# EAGLE design PhatStats Slim Enclosure QTPY PCB v1.00 RTM XPT2406  (EAGLE 7.6.0)
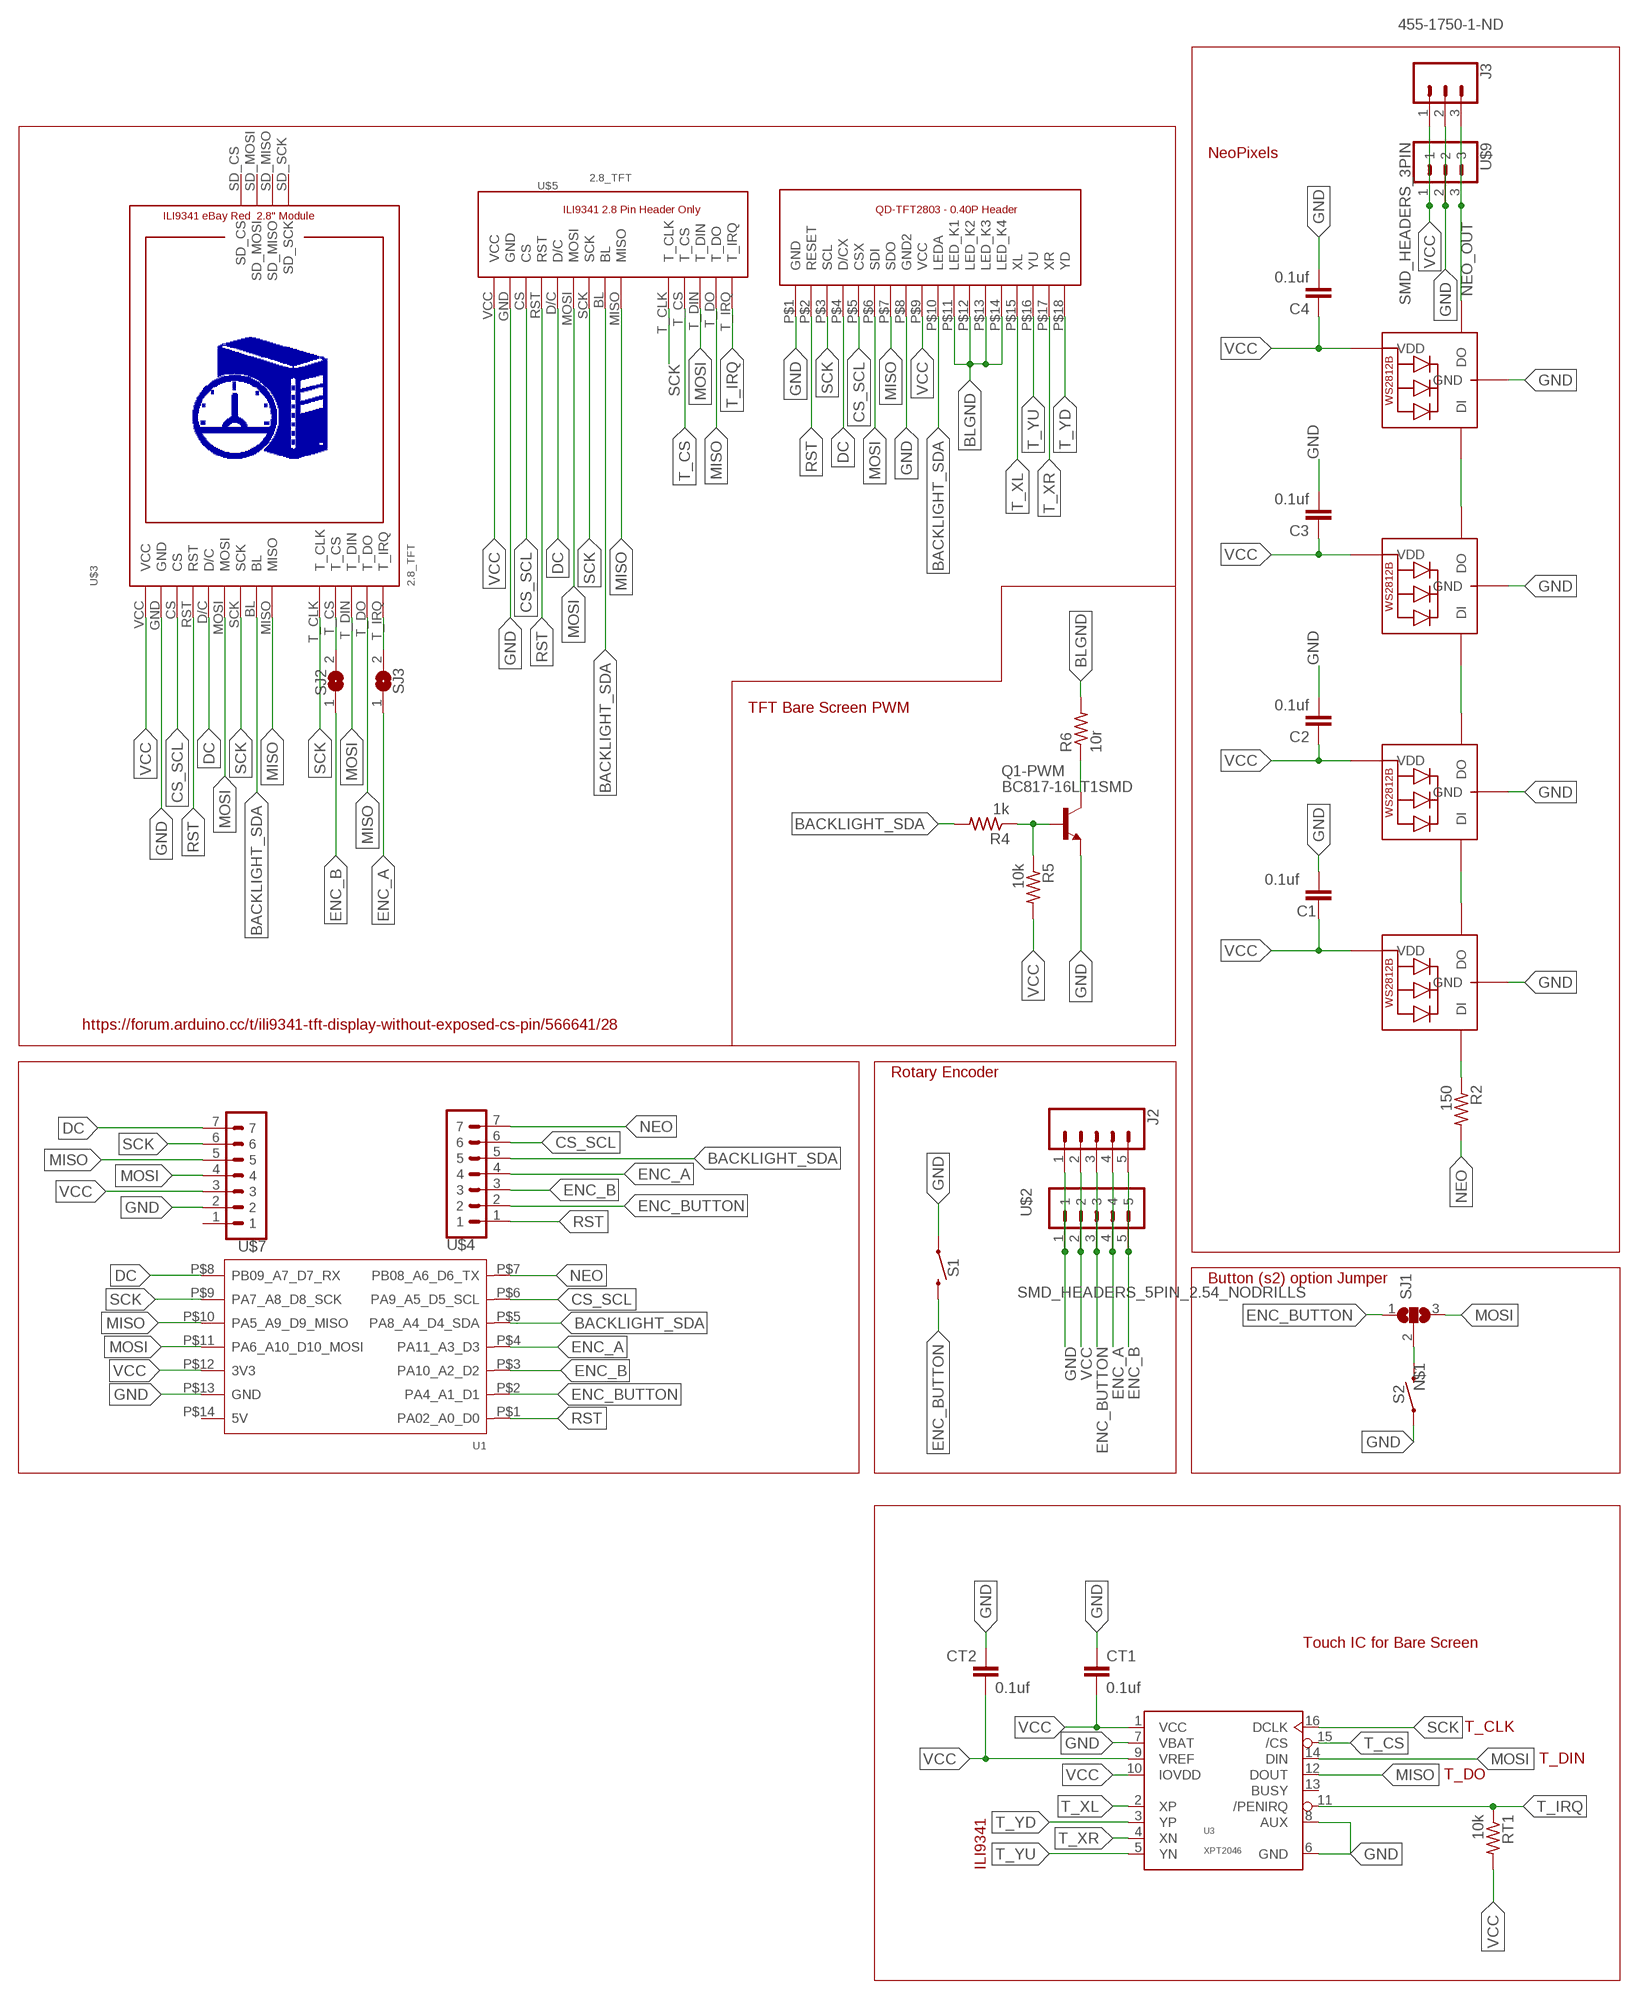
[diagram p0: schematic, sheet 1]

## Parts
0  ILI9341-2.8  [ILI9341-2.8]
C1  0.1uf  C-EUC1206  [C1206]
C2  0.1uf  C-EUC1206  [C1206]
C3  0.1uf  C-EUC1206  [C1206]
C4  0.1uf  C-EUC1206  [C1206]
CT1  0.1uf  C-EUC1206  [C1206]
CT2  0.1uf  C-EUC1206  [C1206]
J2  CONN_05  [1X05]
J3  455-1750-1-ND  CONN_03  [1X03]
NEO1  WS2812B5050  [WS2812B]
NEO2  WS2812B5050  [WS2812B]
NEO3  WS2812B5050  [WS2812B]
NEO4  WS2812B5050  [WS2812B]
Q1-PWM  BC817-16LT1SMD  [SOT23-BEC]
R2  150  R-US_M1206  [M1206]
R4  1k  R-US_M1206  [M1206]
R5  10k  R-US_M1206  [M1206]
R6  10r  R-US_M1206  [M1206]
RT1  10k  R-US_M1206  [M1206]
S1  MOMENTARY-SWITCH-SPST-SMD-6.2MM-TALL  [TACTILE_SWITCH_SMD_6.2MM_TALL]
S2  MOMENTARY-SWITCH-SPST-SMD-6.2MM-TALL  [TACTILE_SWITCH_SMD_6.2MM_TALL]
SJ1  SJ2W  [SJ_2]
SJ2  SJ  [SJ]
SJ3  SJ  [SJ]
U1  MOUDLE-SEEEDUINO-XIAO  [MOUDLE14P-2.54-21X17.8MM]
U3  XPT2046  [TSSOP-16]
U$2  SMD_HEADERS_5PIN_2.54_NODRILLS  [SMD_HEADERS_5PIN]
U$3  2.8_TFT  [2.8_TFT]
U$4  SMD_HEADERS_7PIN_2.54_NODRILLS  [SMD_HEADERS_7PIN]
U$5  2.8_TFT  [2.8_TFT]
U$7  SMD_HEADERS_7PIN_2.54_NODRILLS  [SMD_HEADERS_7PIN]
U$9  SMD_HEADERS_3PIN  [SMD_HEADERS_3PIN]

## Nets
BACKLIGHT_SDA: 0.P$10(LEDA) R4.2 U1.P$5(PA8_A4_D4_SDA) U$3.BL U$4.5 U$5.BL
BLGND: 0.P$11(LED_K1) 0.P$12(LED_K2) 0.P$13(LED_K3) 0.P$14(LED_K4) R6.2
CS_SCL: 0.P$5(CSX) U1.P$6(PA9_A5_D5_SCL) U$3.CS U$4.6 U$5.CS
DC: 0.P$4(D/CX) U1.P$8(PB09_A7_D7_RX) U$3.D/C U$5.D/C U$7.7
ENC_A: J2.4 SJ3.1 U1.P$4(PA11_A3_D3) U$2.4 U$4.4
ENC_B: J2.5 SJ2.1 U1.P$3(PA10_A2_D2) U$2.5 U$4.3
ENC_BUTTON: J2.3 S1.B2 SJ1.1 U1.P$2(PA4_A1_D1) U$2.3 U$4.2
GND: 0.P$1(GND) 0.P$8(GND2) C1.1 C2.2 C3.2 C4.2 CT1.1 CT2.1 J2.1 J3.2 NEO1.3-GND(GND) NEO2.3-GND(GND) NEO3.3-GND(GND) NEO4.3-GND(GND) Q1-PWM.E S1.A2 S2.A2 U1.P$13(GND) U3.6(GND) U3.7(VBAT) U3.8(AUX) U$2.1 U$3.GND U$5.GND U$7.2 U$9.2
MISO: 0.P$7(SDO) U1.P$10(PA5_A9_D9_MISO) U3.12(DOUT) U$3.MISO U$3.T_DO U$5.MISO U$5.T_DO U$7.5
MOSI: 0.P$6(SDI) SJ1.3 U1.P$11(PA6_A10_D10_MOSI) U3.14(DIN) U$3.MOSI U$3.T_DIN U$5.MOSI U$5.T_DIN U$7.4
N$1: S2.B2 SJ1.2
N$2: Q1-PWM.B R4.1 R5.1
N$3: NEO2.2-DOUT(DO) NEO3.4-DIN(DI)
N$4: NEO1.4-DIN(DI) R2.1
N$5: NEO3.2-DOUT(DO) NEO4.4-DIN(DI)
N$6: Q1-PWM.C R6.1
NEO: R2.2 U1.P$7(PB08_A6_D6_TX) U$4.7
NEO_OUT: J3.3 NEO4.2-DOUT(DO) U$9.3
NEODATA: NEO1.2-DOUT(DO) NEO2.4-DIN(DI)
RST: 0.P$2(RESET) U1.P$1(PA02_A0_D0) U$3.RST U$4.1 U$5.RST
SCK: 0.P$3(SCL) U1.P$9(PA7_A8_D8_SCK) U3.16(DCLK) U$3.SCK U$3.T_CLK U$5.SCK U$5.T_CLK U$7.6
T_CS: SJ2.2 U3.15(/CS) U$3.T_CS U$5.T_CS
T_IRQ: RT1.1 SJ3.2 U3.11(/PENIRQ) U$3.T_IRQ U$5.T_IRQ
T_XL: 0.P$15(XL) U3.2(XP)
T_XR: 0.P$17(XR) U3.4(XN)
T_YD: 0.P$18(YD) U3.3(YP)
T_YU: 0.P$16(YU) U3.5(YN)
VCC: 0.P$9(VCC) C1.2 C2.1 C3.1 C4.1 CT1.2 CT2.2 J2.2 J3.1 NEO1.1-VDD(VDD) NEO2.1-VDD(VDD) NEO3.1-VDD(VDD) NEO4.1-VDD(VDD) R5.2 RT1.2 U1.P$12(3V3) U3.1(VCC) U3.9(VREF) U3.10(IOVDD) U$2.2 U$3.VCC U$5.VCC U$7.3 U$9.1
Unconnected: U1.P$14(5V) U3.13(BUSY) U$3.SD_CS U$3.SD_MISO U$3.SD_MOSI U$3.SD_SCK U$7.1

## Notes on the sheet
- NeoPixels
- TFT Bare Screen PWM
- https://forum.arduino.cc/t/ili9341-tft-display-without-exposed-cs-pin/566641/28
- Rotary Encoder
- Button (s2) option Jumper
- Touch IC for Bare Screen
- T_CLK
- T_DIN
- T_DO
- ILI9341

## Library data of the parts
0 = TML_ili9341_0.8Pitch_Header:ILI9341-2.8
C1-C4 CT1 CT2 = rcl:C-EU: CAPACITOR, European symbol
J2 = SparkFun-Connectors:CONN_05: Multi connection point. Often used as Generic Header-pin footprint for 0.1 inch spaced/style header connections On any of the 0.1 inch spaced packages, you can populate with these: Break Away Headers - Straight <https://www.sparkfun.com/products/116> (PRT-00116) Break Away Male Headers - Right Angle <https://www.sparkfun.com/products/553> (PRT-00553) Female Headers <https://www.sparkfun.com/products/115> (PRT-00115) Break Away Headers - Machine Pin <https://www.sparkfun.com/products/117> (PRT-00117) Break Away Female Headers - Swiss Machine Pin <https://www.sparkfun.com/products/743> (PRT-00743) For SCREWTERMINALS and SPRING TERMINALS visit here: Screw Terimnals on SparkFun.com <https://www.sparkfun.com/search/results?term=Screw+Terminals> (5mm/3.5mm/2.54mm spacing) This device is also useful as a general connection point to wire up your design to another part of your project. Our various solder wires solder well into these plated through hole pads. Hook-Up Wire - Assortment (Stranded, 22 AWG) <https://www.sparkfun.com/products/11375> (PRT-11375) Hook-Up Wire - Assortment (Solid Core, 22 AWG) <https://www.sparkfun.com/products/11367> (PRT-11367) View the entire wire category on our website here <https://www.sparkfun.com/categories/141> Special notes: Molex polarized connector foot print use with SKU : PRT-08231 with associated crimp pins and housings. 1MM SMD Version SKU: PRT-10208
J3 = SparkFun-Connectors:CONN_03: Multi connection point. Often used as Generic Header-pin footprint for 0.1 inch spaced/style header connections On any of the 0.1 inch spaced packages, you can populate with these: Break Away Headers - Straight <https://www.sparkfun.com/products/116> (PRT-00116) Break Away Male Headers - Right Angle <https://www.sparkfun.com/products/553> (PRT-00553) Female Headers <https://www.sparkfun.com/products/115> (PRT-00115) Break Away Headers - Machine Pin <https://www.sparkfun.com/products/117> (PRT-00117) Break Away Female Headers - Swiss Machine Pin <https://www.sparkfun.com/products/743> (PRT-00743) Stackable Header - 3 Pin (Female, 0.1") <https://www.sparkfun.com/products/13875> (PRT-13875) For SCREWTERMINALS and SPRING TERMINALS visit here: Screw Terimnals on SparkFun.com <https://www.sparkfun.com/search/results?term=Screw+Terminals> (5mm/3.5mm/2.54mm spacing) This device is also useful as a general connection point to wire up your design to another part of your project. Our various solder wires solder well into these plated through hole pads. Hook-Up Wire - Assortment (Stranded, 22 AWG) <https://www.sparkfun.com/products/11375> (PRT-11375) Hook-Up Wire - Assortment (Solid Core, 22 AWG) <https://www.sparkfun.com/products/11367> (PRT-11367) View the entire wire category on our website here <https://www.sparkfun.com/categories/141> Special notes: Molex polarized connector foot print use with SKU : PRT-08232 with associated crimp pins and housings.; PROD_ID: XXX-00000
NEO1-NEO4 = adafruit:WS2812B
Q1-PWM = transistor-npn:BC817*: NPN Transistor
R2 R4-R6 RT1 = resistor:R-US_: RESISTOR, American symbol
S1 S2 = SparkFun-Switches:MOMENTARY-SWITCH-SPST: Momentary Switch (Pushbutton) - SPST Normally-open (NO) SPST momentary switches (buttons, pushbuttons). Variants PTH-12MM - 12mm square, through-hole Momentary Pushbutton Switch - 12mm Square <https://www.sparkfun.com/products/9190> (COM-09190) PTH-6.0MM, PTH-6.0MM-KIT - 6.0mm square, through-hole Mini Pushbutton Switch <https://www.sparkfun.com/products/97> (COM-00097) KIT package intended for soldering kit's - only one side of pads' copper is exposed. PTH-RIGHT-ANGLE-KIT - Right-angle, through-hole Right Angle Tactile Button <https://www.sparkfun.com/products/10791> - Used on SparkFun BigTime Watch Kit <https://www.sparkfun.com/products/11734> SMD-12MM - 12mm square, surface-mount Tactile Button - SMD (12mm) <https://www.sparkfun.com/products/12993> (COM-12993) Used on SparkFun PicoBoard <https://www.sparkfun.com/products/11888> SMD-4.5MM - 4.5mm Square Trackball Switch Used on SparkFun Blackberry Trackballer Breakout <https://www.sparkfun.com/products/13169> SMD-4.6MMX2.8MM - 4.60mm x 2.80mm, surface mount Used on SparkFun SAMD21 Mini Breakout <https://www.sparkfun.com/products/13664> SMD-5.2MM, SMD-5.2-REDUNDANT - 5.2mm square, surface-mount Mini Pushbutton Switch - SMD <https://www.sparkfun.com/products/8720> (COM-08720) Used on Arduino Pro Mini <https://www.sparkfun.com/products/11114> REDUNDANT package connects both switch circuits together SMD-6.0X3.5MM - 6.0 x 3.5mm, surface mount Momentary Reset Switch SMD <https://www.sparkfun.com/products/8229> (COM-08229) SMD-6.2MM-TALL - 6.2mm square, surface mount Tactile Button - SMD (6mm) <https://www.sparkfun.com/products/12992> Used on SparkFun Digital Sandbox <https://www.sparkfun.com/products/12651> SMD-RIGHT-ANGLE - Right-angle, surface mount Used on SparkFun Block for Intel® Edison - Arduino <https://www.sparkfun.com/products/13036>; PROD_ID: SWCH-11966; SF_SKU: COM-12992
SJ1 = jumper:SJ2W: SMD solder JUMPER
SJ2 SJ3 = jumper:SJ: SMD solder JUMPER
U1 = TML_Seeeduino XIAO_QTPY_ThroughHole_ONLY_V1.1:MOUDLE-SEEEDUINO-XIAO
U3 = TML_XPT2046:XPT2046: XPT2046 touch screen controller General Description The XPT2046 is a 4-wire resistive touch screen controller that incorporates a 12-bit 125 kHz sampling SAR type A/D converter. The XPT2046 operates down to 2.2V supply voltage and supports digital I/O interface voltage from 1.5V to VCC in order to connect low voltage uP. The XPT2046 can detect the pressed screen location by performing two A/D conversions. In addition to location, the XPT2046 also measures touch screen pressure.On-chip VREF can be utilized for analog auxiliary input, temperature measurement and battery monitoring withthe ability to measure voltage from 0V to 5V. The XPT2046 also has an on-chip temperature sensor The XPT2046 is available in 16pin QFN thin package(0.75mm in height) and has the operating temperature range of -40°C to +85°C Features 12 bit SAR type A/D converter with S/H circuit Low voltage operation (VCC = 2.2V ∼ 3.6V) Low voltage digital I/F (1.5V ∼ VCC) 4-wire I/F Sampling frequency: 125 kHz (max) On-Chip voltage reference (2.5V) Pen pressure measurement On-chip thermo sensor Direct battery masurement Low power consumption (260μA) Package 16pin QFN Check prices <https://pricing.snapeda.com/parts/XPT2046/Xptek/view-part?ref=eda>; AVAILABILITY: Not in stock; DESCRIPTION: RASPBERRY PI 3.5 TFT DISPLAY; MF: Xptek; MP: XPT2046; PACKAGE: Package; PRICE: None
U$2 = TML_SMD_Headers_2.54_NoDrill:SMD_HEADERS_5PIN_2.54_NODRILLS
U$3 = TML_ili9341-2.8_tft-display_Corrected:2.8_TFT: ILI9341 2.8" 2.8 inch TFT SPI Touch Panel 240X320 http://www.lcdwiki.com/2.8inch_SPI_Module_ILI9341_SKU:MSP2807 http://www.lcdwiki.com/Run_Arduino_Demo_in_spi_model
U$4 U$7 = TML_SMD_Headers_2.54_NoDrill:SMD_HEADERS_7PIN_2.54_NODRILLS
U$5 = TML_ili9341-2.8_tft-display_PinHeader only:2.8_TFT: ILI9341 2.8" 2.8 inch TFT SPI Touch Panel 240X320 http://www.lcdwiki.com/2.8inch_SPI_Module_ILI9341_SKU:MSP2807 http://www.lcdwiki.com/Run_Arduino_Demo_in_spi_model
U$9 = TML_SMD_Headers_2.54_NoDrill:SMD_HEADERS_3PIN

## Board
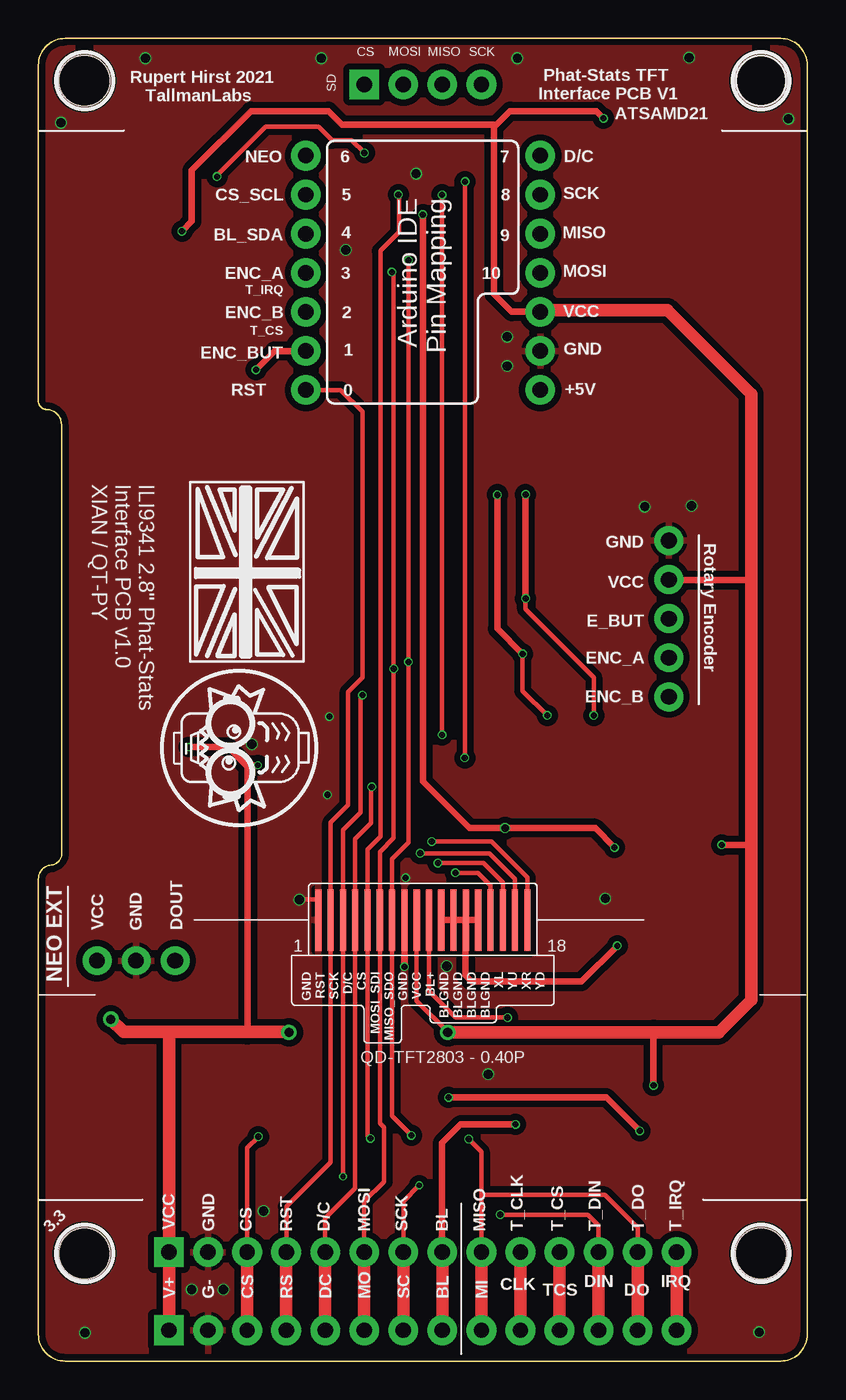
[diagram p1: board, top side]
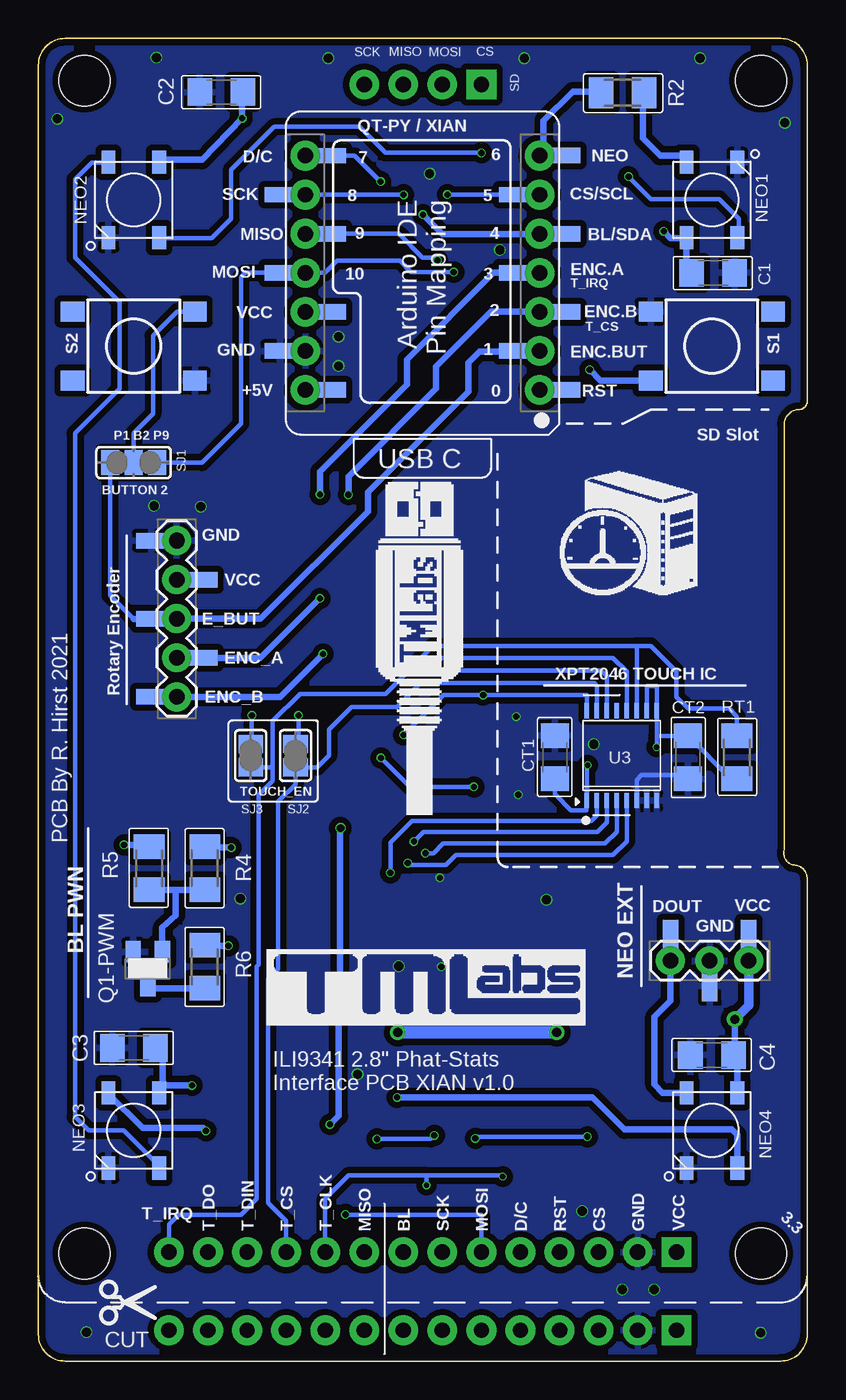
[diagram p2: board, bottom side, seen from below]

Size 50 x 86 mm. Coordinates in mm from the lower left corner, seen from the top.
Outline: 50,84.27 50,1.73 arc-90 48.27,0 1.73,0 arc-90 0,1.73 0,31.35 arc-90 0.9,32.25 arc90 1.5,33.23 1.5,60.9 arc90 0.52,61.88 arc-90 0,62.4 0,84.27 arc-90 1.73,86 48.27,86 arc-90 50,84.27
Copper layers (1*16): Top 0.035mm / dielectric 1.6mm / Bottom 0.035mm
Design rules "jlcpcb-2layers": minimum track width 5mil, minimum drill 0.3mm, track to track 5mil, track to pad 5mil, pad to pad 5mil, via to via 5mil, smd to smd 5mil, copper to edge 0.2mm, drill to drill 6mil, minimum pad ring 10mil, minimum via ring 3mil, stop-mask expansion 4mil, vias tented up to drill 0mil, thermal gap 10mil
Holes 3.3 mm at 3,83.25 47,83.25 47,7 3,7

### Footprints (pad centres in the part's own frame; a part is rotated, then mirrored left to right if it is on the bottom)
ILI9341-2.8 = smd 4 x 0.4: P$1 -18,6.8; P$2 -18,6; P$3 -18,5.2; P$4 -18,4.4; P$5 -18,3.6; P$6 -18,2.8; P$7 -18,2; P$8 -18,1.2; P$9 -18,0.4; P$10 -18,-0.4; P$11 -18,-1.2; P$12 -18,-2; P$13 -18,-2.8; P$14 -18,-3.6; P$15 -18,-4.4; P$16 -18,-5.2; P$17 -18,-6; P$18 -18,-6.8
C1206 = smd 1.6 x 1.8: 1 -1.4,0; 2 1.4,0
1X05 = drill 1.016 pad 1.88: 1 0,0; 2 2.54,0; 3 5.08,0; 4 7.62,0; 5 10.16,0
1X03 = drill 1.016 pad 1.88: 1 0,0; 2 2.54,0; 3 5.08,0
WS2812B = smd 1.5 x 0.9: 1-VDD 2.45,-1.65; 2-DOUT 2.45,1.65; 3-GND -2.45,1.65; 4-DIN -2.45,-1.65
SOT23-BEC = smd 1 x 1.4: B -0.95,-1.1; C 0,1.1; E 0.95,-1.1
M1206 = smd 1.6 x 2: 1 -1.4,0; 2 1.4,0
TACTILE_SWITCH_SMD_6.2MM_TALL = smd 1.55 x 1.3: A1 -3.975,-2.25; A2 3.975,-2.25; B1 -3.975,2.25; B2 3.975,2.25
SJ_2 = smd 1.168 x 1.6: 1 -1.524,0; 2 0,0; 3 1.524,0
SJ = smd 1.168 x 1.6: 1 -0.762,0; 2 0.762,0
MOUDLE14P-2.54-21X17.8MM = drill 1 pad 1.93: P$1 -1.905,15.24; P$2 -1.905,12.7; P$3 -1.905,10.16; P$4 -1.905,7.62; P$5 -1.905,5.08; P$6 -1.905,2.54; P$7 -1.905,0; P$8 13.335,0; P$9 13.335,2.54; P$10 13.335,5.08; P$11 13.335,7.62; P$12 13.335,10.16; P$13 13.335,12.7; P$14 13.335,15.24
TSSOP-16 = smd 0.305 x 0.991: 1 -2.275,-2.918; 2 -1.625,-2.918; 3 -0.975,-2.918; 4 -0.325,-2.918; 5 0.325,-2.918; 6 0.975,-2.918; 7 1.625,-2.918; 8 2.275,-2.918; 9 2.275,2.918; 10 1.625,2.918; 11 0.975,2.918; 12 0.325,2.918; 13 -0.325,2.918; 14 -0.975,2.918; 15 -1.625,2.918; 16 -2.275,2.918
SMD_HEADERS_5PIN = smd 1 x 2: 1 1.27,-0.38; 2 3.81,2.92; 3 6.35,-0.38; 4 8.89,2.92; 5 11.43,-0.38
2.8_TFT = drill 1 pad 1.93: BL 26.27,2; CS 13.57,2; D/C 18.65,2; GND 11.03,2; MISO 28.81,2; MOSI 21.19,2; RST 16.11,2; SCK 23.73,2; SD_MISO 26.27,83; SD_MOSI 23.73,83; SD_SCK 28.81,83; T_CLK 31.35,2; T_CS 33.89,2; T_DIN 36.43,2; T_DO 38.97,2; T_IRQ 41.51,2 | drill 1 pad 1.93 square: SD_CS 21.19,83; VCC 8.49,2
SMD_HEADERS_7PIN = smd 1 x 2: 1 1.27,-0.38; 2 3.81,2.92; 3 6.35,-0.38; 4 8.89,2.92; 5 11.43,-0.38; 6 13.97,2.92; 7 16.51,-0.38
2.8_TFT' = drill 1 pad 1.93: BL 26.27,2; CS 13.57,2; D/C 18.65,2; GND 11.03,2; MISO 28.81,2; MOSI 21.19,2; RST 16.11,2; SCK 23.73,2; T_CLK 31.35,2; T_CS 33.89,2; T_DIN 36.43,2; T_DO 38.97,2; T_IRQ 41.51,2 | drill 1 pad 1.93 square: VCC 8.49,2
SMD_HEADERS_3PIN = smd 1 x 2: 1 1.27,-0.38; 2 3.81,2.92; 3 6.35,-0.38

### Placement (x,y rotation side)
0  25,46.68 90 top
C1  6.12,70.76 180 bottom
C2  38.11,82.51 180 bottom
C3  43.8,20.36 180 bottom
C4  6.2,19.9 180 bottom
CT1  16.41,39.27 270 bottom
CT2  7.77,39.27 90 bottom
J2  41,53.35 270 bottom
J3  3.81,26.04 180 bottom
NEO1  6.2,75.5 270 bottom
NEO2  43.8,75.5 90 bottom
NEO3  43.8,15 90 bottom
NEO4  6.2,15 90 bottom
Q1-PWM  42.89,25.51 180 bottom
R2  12,82.47 180 bottom
R4  39.18,32.05 90 bottom
R5  42.8,32.05 90 bottom
R6  39.18,25.64 90 bottom
RT1  4.57,39.27 270 bottom
S1  6.2,66 180 bottom
S2  43.8,66 0 bottom
SJ1  43.81,58.42 0 bottom
SJ2  33.28,39.37 270 bottom
SJ3  36.2,39.37 270 bottom
U1  19.3,78.38 180 bottom
U3  12.06,39.37 0 bottom
U$1  [TMSLOGO_PROF_UNION_LRG]  9.65,59.38 270 top
U$2  42.27,54.62 270 bottom
U$3  0,0 0 top
U$4  16.13,61.87 90 bottom
U$5  2.8_TFT  [2.8_TFT']  0,5.08 0 top
U$6  [HSMSMALL]  15.88,48.9 0 bottom
U$7  31.37,61.87 90 bottom
U$8  [TMLUSBMEDIUM]  25.4,62.87 0 bottom
U$9  2.54,27.3 180 bottom
U$10  [SCISSORS_TS]  46.61,5.08 0 bottom
U$14  [TMSLOGO_INVERTED]  35.8,20.49 0 bottom

### Tracks (layer width: path | path; a pad name or v marks a point on that pad's centre or on a via)
BACKLIGHT_SDA  (via drill 0.4, 0.5)
  Top 0.305: 0.P$10 25.39,24.07 27.12,22.34 v30.51,22.34
  Top 0.406: v25,74.54 25,37.7 28.05,34.65 v30.35,34.65 36.21,34.65 v37.47,33.4 | v31.03,15.39 27.46,15.39 26.25,14.18 26.25,7.1 U$5.BL
  Top 0.813: U$3.BL U$5.BL
  Bottom 0.406: 31.03,15.43 v31.03,15.39 30.48,15.94 30.48,22.31 v30.51,22.34 30.38,22.46 30.38,34.63 v30.35,34.65 | R4.2 39.23,33.45 39.37,33.4 v37.47,33.4 | U$4.5 U1.P$5 17.4,73.28 | 17.4,73.28 | 17.4,73.28 23.73,73.28 v25,74.54
BLGND  (via drill 0.4)
  Top 0.406: 0.P$14 0.P$13 | 0.P$11 0.P$12 0.P$13 | 0.P$13 27.79,25.07 28.17,24.68 35.32,24.68 v37.65,27
  Bottom 0.406: v37.65,27 38.62,27 R6.2
CS_SCL  (via drill 0.4)
  Top 0.305: v21.59,14.48 21.54,14.48 21.4,14.62 0.P$5 21.4,33.26 22.24,34.1 22.24,72.2 23.44,73.4 23.44,75.81 v23.41,75.84 | U$5.CS 13.57,13.86 v14.3,14.59
  Top 0.813: U$3.CS U$5.CS
  Bottom 0.305: v23.41,75.84 U1.P$6 | v21.59,14.48 21.43,14.59 v14.3,14.59
  Bottom 0.406: U$4.6 U1.P$6
DC  (via drill 0.4)
  Top 0.305: U$5.D/C 18.65,9.3 20.6,11.25 0.P$4 20.6,33.96 21.64,35 21.64,37.26 21.72,37.34 v21.68,37.34 | v27.73,39.22 27.75,39.24 v27.75,76.69
  Top 0.813: U$3.D/C U$5.D/C
  Bottom 0.152: 32.39,78.38 32.38,78.38
  Bottom 0.305: 32.38,78.38 29.44,78.38 v27.75,76.69 | v21.68,37.34 25.85,37.34 v27.73,39.22
  Bottom 0.406: 32.38,78.38 U$7.7 | U1.P$8 32.39,78.38
ENC_A  (via drill 0.4)
  Top 0.305: v36.12,41.98 36.12,44.45 31.69,48.88 v31.69,49.59
  Top 0.406: v31.69,49.59 v31.69,56.35
  Bottom 0.305: v36.12,41.98 36.12,40.2 SJ3.1
  Bottom 0.406: v31.69,56.35 31.69,57.85 26.04,63.5 26.04,65.13 20.41,70.76 U1.P$4 U$4.4 | v31.69,49.59 31.71,49.59 35.57,45.73 J2.4 U$2.4
ENC_B  (via drill 0.4)
  Top 0.305: v31.49,45.98 31.49,43.59 v33.09,41.98
  Top 0.406: v29.84,56.33 29.84,47.62 v31.49,45.98
  Bottom 0.305: v33.09,41.98 33.09,40.32 SJ2.1
  Bottom 0.406: 29.86,56.32 v29.84,56.33 29.84,57.52 24.13,63.24 24.13,64.66 20.56,68.22 U1.P$3 15.76,68.22 U$4.3 | v31.49,45.98 34.29,43.18 J2.5 U$2.5
ENC_BUTTON  (via drill 0.4)
  Top 0.406: v14.15,64.46 15.36,65.68 U1.P$2
  Bottom 0.305: 43.81,48.26 45.34,49.78 SJ1.1 | J2.3 40.99,48.28
  Bottom 0.406: S1.B2 10.33,63.69 10.39,63.75 13.44,63.75 v14.15,64.46 | J2.3 40.99,48.28 35.54,48.28 28.57,55.24 28.57,56.52 22.04,63.05 22.04,64.92 21.33,65.62 19.06,65.62 U$4.2 U1.P$2 | 43.81,48.26 U$2.3 | J2.3 U$2.3 | U$2.3
GND  (via drill 0.4, 0.6)
  Top 0.305: v23.8,25.64 | v16.96,30 18.19,30 0.P$1
  Top 0.406: v23.8,25.64 0.P$8
  Bottom 0.305: 7.77,37.2 CT2.1 8.02,38.1 10.79,38.1 11.09,37.8 U3.6
  other vias: 46.88,1.88 3.02,1.84 12.03,4.65 1.46,80.52 48.77,80.78 6.96,84.72 26.56,25.67 9.96,4.65 18.4,84.72 31.15,84.72 24.56,77.21 30.48,66.6 42.32,84.75 30.48,64.7 29.25,18.64 14.64,9.76 13.88,40.11 18.8,36.83 36.87,30.07 42.48,55.62 39.43,55.55 19.99,72.25 18.92,41.91 23.88,31.41
  pour Bottom (isolate 0.406): -1.27,-1.27 -1.27,86.36 50.8,86.36 50.8,-1.27
  pour Top (isolate 0.406): -2.54,-2.54 -2.54,87.63 52.07,87.44 52.07,-2.54
MISO  (via drill 0.4)
  Top 0.305: v24.26,14.67 24.26,14.69 23,15.95 0.P$7 23,32.65 24.06,33.71 v24.06,45.46 v24.06,71.57 | v27.98,14.44 28.81,13.61 28.81,10.79 | 28.81,10.79 U$5.MISO | U$5.T_DO 38.97,8.65 36.83,10.79 28.81,10.79
  Top 0.813: U$3.MISO U$5.MISO | U$3.T_DO U$5.T_DO
  Bottom 0.305: v24.26,14.67 24.49,14.44 v27.98,14.44 | v24.06,71.57 24.25,71.75 25.02,71.75 26.56,73.29 U$7.5 32.63,73.29 U1.P$10 | U3.12 11.74,44.82 12.64,45.72 23.8,45.72 v24.06,45.46
MOSI  (via drill 0.4)
  Top 0.305: 0.P$6 22.2,15.46 22.48,15.19 22.48,11.66 21.19,10.39 21.19,7.26 U$5.MOSI | 0.P$6 | 0.P$6 22.2,33.11 23.11,34.02 v23.11,45.01 23.11,70.74 v22.99,70.81 | U$5.T_DIN 36.43,8.84 35.75,9.53 v30.03,9.53
  Top 0.813: U$3.MOSI U$5.MOSI | U$3.T_DIN U$5.T_DIN
  Bottom 0.305: U1.P$11 31.37,70.76 30.59,71.54 26.5,71.54 25.77,70.81 v22.99,70.81 | U$5.MOSI 21.19,9.53 v30.03,9.53 | 33.65,70.76 36.56,70.76 36.83,70.48 36.83,60.96 39.37,58.42 SJ1.3 | U3.14 13.04,44.53 13.4,44.9 22.99,44.9 v23.11,45.01
  Bottom 0.406: U$7.4 33.65,70.76 U1.P$11
N$1
  Bottom 0.305: S2.B2 40.97,68.25 42.55,66.67 42.55,61.59 43.81,60.33 SJ1.2
N$2
  Bottom 0.406: R4.1 41.06,30.65 | 41.06,30.65 R5.1 | Q1-PWM.B 41.94,28.18 41.06,28.99 41.06,30.65
N$3
  Bottom 0.305: NEO2.2-DOUT 45.48,77.92 46.54,77.92 47.62,76.83 47.62,71.75 44.71,68.84 44.71,63.24 47.62,60.33 47.62,15.88 46.74,14.99 44.45,14.99 42.15,12.69 NEO3.4-DIN
N$4
  Bottom 0.406: NEO1.4-DIN 8.06,78.38 9.56,78.38 10.69,79.5 10.69,81.56 R2.1
N$5  (via drill 0.4)
  Top 0.406: v26.67,17.14 36.92,17.14 v39.11,14.96
  Bottom 0.406: NEO4.4-DIN 4.55,14.71 4.89,15.05 11.88,15.05 13.97,17.14 v26.67,17.14 | 45.45,17.14 NEO3.2-DOUT 45.45,17.38 43.22,15.15 39.3,15.15 v39.11,14.96
N$6
  Bottom 0.406: R6.1 42.72,24.24 Q1-PWM.C
NEO
  Bottom 0.406: R2.2 13.97,82.55 15.24,82.55 17.14,80.64 17.14,78.74 U1.P$7 17.02,78.39 U$4.7
NEO_OUT
  Bottom 0.406: NEO4.2-DOUT 9.41,17.45 9.94,17.98 9.94,22.36 8.89,23.41 J3.3 U$9.3
NEODATA  (via drill 0.4)
  Top 0.305: v11.62,77.02 11.62,77.1 14.77,80.25 18.23,80.25 19.11,79.38 20.38,79.38 v21.2,78.56
  Bottom 0.305: v21.2,78.56 27.43,78.56 29.12,80.25 34.69,80.25 37.47,77.47 37.47,74.3 38.73,73.03 42.12,73.03 NEO2.4-DIN | v11.62,77.02 10.16,75.56 5.71,75.56 4.45,74.3 4.45,73.66 NEO1.2-DOUT
RST
  Top 0.305: 16.12,7.47 16.12,10.06 19,12.93 0.P$2 19,35.01 20.14,36.15 20.14,43.51 21.08,44.45 21.08,61.72 19.66,63.14 U1.P$1
  Top 0.813: 16.12,7.47 16.12,7.09 U$5.RST U$3.RST
  Bottom 0.305: 15.77,63.14 U$4.1
  Bottom 0.406: 15.77,63.14 U1.P$1
SCK  (via drill 0.35, 0.4)
  Top 0.305: v26.25,75.84 v26.25,40.72 | v19.81,12 19.8,12.01 0.P$3 19.8,34.53 20.95,35.69 20.95,43.19 v21.07,43.31 | v24.77,11.43 23.73,10.39 U$5.SCK
  Top 0.813: U$3.T_CLK U$5.T_CLK | U$3.SCK U$5.SCK
  Bottom 0.305: U1.P$9 v26.25,75.84 | v19.81,12 19.88,12.06 24.77,12.06 | 24.77,12.06 29.84,12.06 31.35,10.56 U$5.T_CLK | 24.77,12.06 v24.77,11.43 | U3.16 14.34,43.31 v21.07,43.31 23.66,43.31 v26.25,40.72
  Bottom 0.406: U1.P$9 U$7.6
T_CS
  Top 0.813: U$3.T_CS U$5.T_CS
  Bottom 0.305: U$5.T_CS 33.89,9.12 35.06,10.3 35.06,24.86 34.41,25.52 34.41,36.38 33.28,37.51 SJ2.2 31.88,38.61 31.11,39.37 31.11,41.06 29.63,42.55 26.67,42.55 25.14,44.08 13.86,44.08 13.69,43.91 U3.15
T_IRQ
  Top 0.813: U$3.T_IRQ U$5.T_IRQ
  Bottom 0.305: U$5.T_IRQ 41.51,8.89 40.88,9.53 36.83,9.53 35.81,10.54 35.81,25.68 35.69,25.77 35.69,36.8 34.76,37.73 34.76,38.73 | 34.76,38.73 34.76,41.62 33,43.38 27.43,43.38 24.35,46.5 11.11,46.5 | SJ3.2 34.89,38.61 34.76,38.73 | 11.09,46.48 11.11,46.5 | U3.11 11.09,46.48 | 11.09,46.48 | RT1.1 4.57,41.91 5.08,42.42 7.75,42.42 8.51,43.18 8.51,44.83 10.18,46.5 11.11,46.5
T_XL  (via drill 0.4)
  Top 0.305: 0.P$15 29.4,30.93 28.57,31.75 v27.11,31.75
  Bottom 0.305: U3.2 13.69,35.47 14.04,35.12 25.72,35.12 27.11,33.72 v27.11,31.75
T_XR  (via drill 0.4)
  Top 0.305: 0.P$17 31,31.34 29.32,33.02 v24.83,33.02
  Bottom 0.305: U3.4 12.39,34.41 13.15,33.66 23.69,33.66 24.32,33.02 v24.83,33.02
T_YD  (via drill 0.4)
  Top 0.305: 0.P$18 31.8,31.44 29.46,33.78 v25.58,33.78
  Bottom 0.305: U3.3 13.04,35.03 13.65,34.42 24.95,34.42 v25.58,33.78
T_YU  (via drill 0.4)
  Top 0.305: 0.P$16 30.2,31.14 28.95,32.38 v25.98,32.38
  Bottom 0.305: U3.5 11.74,33.79 12.64,32.89 22.86,32.89 23.5,32.26 25.85,32.26 v25.98,32.38
VCC  (via drill 0.35, 0.4, 0.6 pad 1, 0.6 pad 1.02)
  Top 0.152: U1.P$12 32.74,68.32
  Top 0.305: 0.P$9 24.6,23.43 26.62,21.4 v26.62,21.38
  Top 0.406: v36.75,80.81 36.28,81.28 30.67,81.28 29.77,80.39 29.62,80.39 | 29.62,80.39 19.76,80.39 18.86,81.28 13.82,81.28 9.97,77.42 9.97,74.1 v9.33,73.47 | 29.62,80.39 29.62,69.38 30.78,68.22 U1.P$12 | 46.35,50.8 J2.2 | v44.44,33.56 46.35,33.56 | v40.01,17.93 40.01,21.38 | v9.79,39.92 12.33,39.92 13.51,38.74 13.59,38.74 | 13.59,38.74 13.59,21.4 | v14.27,38.74 13.59,38.74
  Top 0.813: 8.26,21.4 13.59,21.4 16.26,21.4 v16.3,21.38 | 8.26,21.4 5.53,21.4 v4.71,22.23 | 32.74,68.32 40.9,68.32 46.35,62.87 46.35,50.8 46.35,33.56 46.35,23.5 44.23,21.38 40.01,21.38 v26.62,21.38 | U$3.VCC U$5.VCC 8.49,21.16 8.26,21.4
  Bottom 0.305: 41.91,78.11 NEO2.1-VDD | v14.27,38.73 v14.27,38.74 14.34,38.81 U3.1 14.35,36.44 14.35,35.81 15.37,35.81 16.41,36.86 CT1.2 16.38,37.83 | 9.79,40.64 U3.9 9.78,43.88 10.41,43.88 10.44,43.85 U3.10 | 9.79,40.64 v9.79,39.92 | 7.79,40.64 CT2.2 4.97,37.87 RT1.2 | 7.73,40.64 7.79,40.64 | 7.79,40.64 9.79,40.64
  Bottom 0.406: v36.75,80.81 36.77,80.81 | NEO4.1-VDD 4.54,19.54 C4.1 4.71,20.32 v4.71,22.23 | v36.75,80.81 36.75,82.47 C2.1 | v36.75,80.81 39.37,78.11 41.91,78.11 | v40.01,17.93 41.91,17.93 | NEO3.1-VDD 41.91,17.78 41.91,17.93 | C1.2 7.85,71.09 NEO1.1-VDD 7.88,73.03 8.89,73.03 v9.33,73.47 | R5.2 43.5,33.56 v44.44,33.56 | C3.1 41.91,19.68 41.91,17.93 | U$7.3 U1.P$12 | J2.2 U$2.2 | J3.1 U$9.1
  Bottom 0.61: v4.71,22.23 3.81,23.12 J3.1
  Bottom 0.813: v26.62,21.38 v16.3,21.38

### Text on the board
tPlace: Rupert Hirst 2021 / TallmanLabs | Phat-Stats TFT / Interface PCB V1 | ATSAMD21 | NEO | 6 | 7 | D/C | CS_SCL | Arduino IDE / Pin Mapping | SCK | 5 | 8 | BL_SDA | 4 | 9 | MISO | ENC_A | T_IRQ | 3 | 10 | MOSI | ENC_B | 2 | VCC | T_CS | ENC_BUT | 1 | GND | RST | 0 | +5V | ILI9341 2.8" Phat-Stats / Interface PCB v1.0 / XIAN / QT-PY | GND | Rotary Encoder | VCC | E_BUT | ENC_A | ENC_B | VCC | GND | DOUT | NEO EXT | QD-TFT2803 - 0.40P | VCC | 3.3 | GND | CS | RST | D/C | MOSI | SCK | BL | MISO | T_CLK | T_CS | T_DIN | T_DO | T_IRQ | DIN | IRQ | CLK | TCS | DO | V+ | G- | CS | RS | DC | MO | SC | BL | MI
bPlace: QT-PY / XIAN | D/C | NEO | 6 | 7 | CS/SCL | Arduino IDE / Pin Mapping | SCK | 5 | 8 | MISO | BL/SDA | 4 | 9 | ENC.A | MOSI | T_IRQ | 3 | 10 | VCC | ENC.B | 2 | T_CS | GND | S1 | ENC.BUT | 1 | RST | +5V | 0 | SD Slot | P1 B2 P9 | BUTTON 2 | GND | VCC | E_BUT | ENC_A | XPT2046 TOUCH IC | ENC_B | Rotary Encoder | TOUCH_EN | PCB By R. Hirst 2021 | VCC | DOUT | GND | BL PWN | NEO EXT | ILI9341 2.8" Phat-Stats / Interface PCB XIAN v1.0 | 3.3 | T_IRQ | VCC | GND | CS | RST | D/C | MOSI | SCK | BL | MISO | T_CLK | T_CS | T_DIN | T_DO